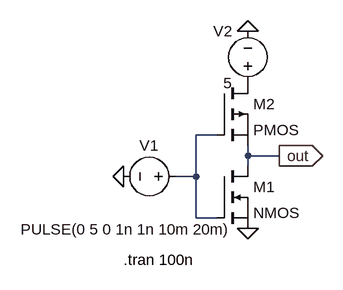
[diagram p0: schematic inverter CMOS.asc]
inverter CMOS.asc, the LTspice schematic file:
Version 4.1
SHEET 1 880 680
WIRE 176 144 144 144
WIRE 224 176 224 160
WIRE 272 176 224 176
WIRE 224 192 224 176
WIRE 144 208 144 144
WIRE 144 208 112 208
WIRE 144 272 144 208
WIRE 176 272 144 272
FLAG 224 288 0
FLAG 224 -16 0
FLAG 272 176 out
IOPIN 272 176 Out
FLAG 32 208 0
SYMBOL nmos 176 192 R0
SYMATTR InstName M1
SYMBOL pmos 176 64 R0
SYMATTR InstName M2
SYMBOL voltage 128 208 R90
WINDOW 0 -32 56 VBottom 2
WINDOW 3 66 92 VTop 2
WINDOW 123 0 0 Left 0
WINDOW 39 0 0 Left 0
SYMATTR InstName V1
SYMATTR Value PULSE(0 5 0 1n 1n 10m 20m)
SYMBOL voltage 224 80 R180
WINDOW 0 24 96 Left 2
WINDOW 3 24 16 Left 2
WINDOW 123 0 0 Left 0
WINDOW 39 0 0 Left 0
SYMATTR InstName V2
SYMATTR Value 5
TEXT 32 336 Left 2 !.tran 100n

The netlist it stands for:
* inverter CMOS.asc
M1 out N001 0 0 NMOS
M2 P001 N001 out out PMOS
V1 N001 0 PULSE(0 5 0 1n 1n 10m 20m)
V2 P001 0 5
.model NMOS NMOS
.model PMOS PMOS
.lib standard.mos
.tran 100n
.backanno
.end